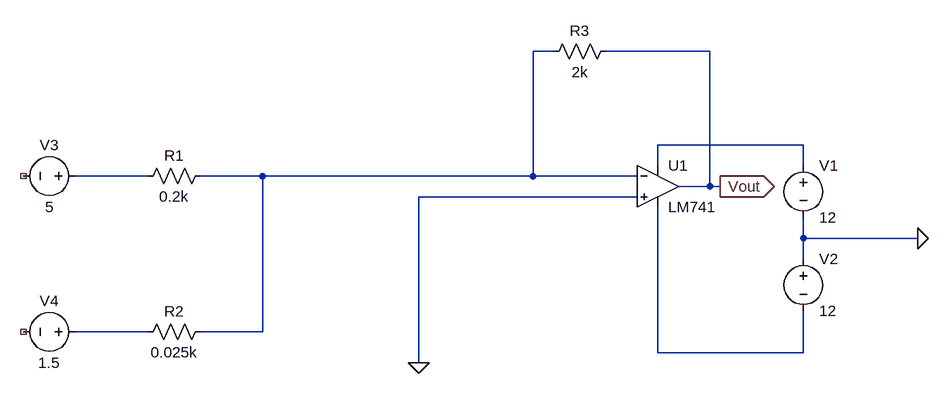
[diagram p0: schematic Draft4.asc]
Draft4.asc, the LTspice schematic file:
Version 4
SHEET 1 880 712
WIRE 48 -16 16 -16
WIRE 288 -16 128 -16
WIRE 432 128 208 128
WIRE 208 160 208 128
WIRE 432 160 432 128
WIRE -576 176 -688 176
WIRE -400 176 -496 176
WIRE 16 176 16 -16
WIRE 16 176 -400 176
WIRE 176 176 16 176
WIRE 288 192 288 -16
WIRE 288 192 240 192
WIRE 304 192 288 192
WIRE 176 208 -160 208
WIRE 432 272 432 240
WIRE 608 272 432 272
WIRE 432 304 432 272
WIRE -576 416 -688 416
WIRE -400 416 -400 176
WIRE -400 416 -496 416
WIRE 208 448 208 224
WIRE 432 448 432 384
WIRE 432 448 208 448
WIRE -160 464 -160 208
FLAG 304 192 Vout
IOPIN 304 192 Out
FLAG -160 464 0
FLAG 608 272 0
SYMBOL OpAmps\\LM741 208 128 R0
SYMATTR InstName U1
SYMBOL res -480 160 R90
WINDOW 0 0 56 VBottom 2
WINDOW 3 32 56 VTop 2
SYMATTR InstName R1
SYMATTR Value 0.2k
SYMBOL res -480 400 R90
WINDOW 0 0 56 VBottom 2
WINDOW 3 32 56 VTop 2
SYMATTR InstName R2
SYMATTR Value 0.025k
SYMBOL res 144 -32 R90
WINDOW 0 0 56 VBottom 2
WINDOW 3 32 56 VTop 2
SYMATTR InstName R3
SYMATTR Value 2k
SYMBOL voltage -672 176 R90
WINDOW 0 -32 56 VBottom 2
WINDOW 3 32 56 VTop 2
WINDOW 123 0 0 Left 0
WINDOW 39 0 0 Left 0
SYMATTR InstName V3
SYMATTR Value 5
SYMBOL voltage -672 416 R90
WINDOW 0 -32 56 VBottom 2
WINDOW 3 32 56 VTop 2
WINDOW 123 0 0 Left 0
WINDOW 39 0 0 Left 0
SYMATTR InstName V4
SYMATTR Value 1.5
SYMBOL voltage 432 144 R0
WINDOW 123 0 0 Left 0
WINDOW 39 0 0 Left 0
SYMATTR InstName V1
SYMATTR Value 12
SYMBOL voltage 432 288 R0
WINDOW 123 0 0 Left 0
WINDOW 39 0 0 Left 0
SYMATTR InstName V2
SYMATTR Value 12

The netlist it stands for:
* Draft4.asc
XU1 0 N001 N002 N005 Vout LM741  ; pins In+ In- V+ V- OUT
R1 N001 N003 0.2k
R2 N001 N004 0.025k
R3 Vout N001 2k
V3 N003 NC_01 5
V4 N004 NC_02 1.5
V1 N002 0 12
V2 0 N005 12
.lib LM741.lib
.backanno
.end